# Altium schematic sheet MicroSD.SchDoc
size A; SheetNumber: 9; SheetTotal: 10
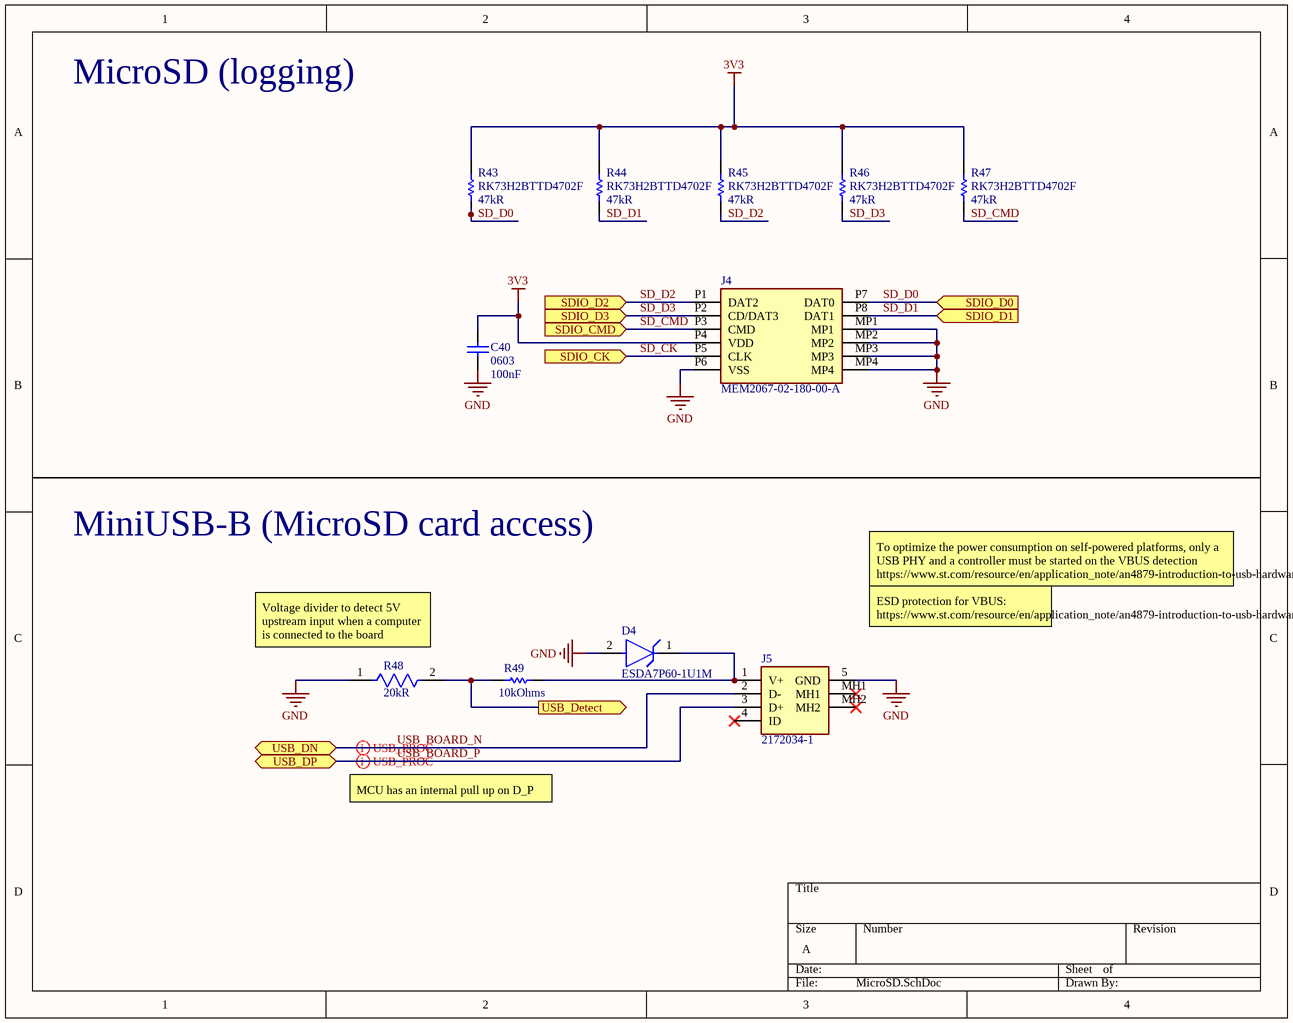
[diagram p0: MicroSD.SchDoc]

## Parts
C40  Case Code (Imperial): 0603  Capacitance: 100nF  [CAPC1608X87X35NL15T15]  (hidden comment: C0603X104K5RACTU)
D4  ESDA7P60-1U1M  [FP-1610-MFG]
J4  MEM2067-02-180-00-A  [MEM20670218000A]
J5  2172034-1  [21720341]
R43  RK73H2BTTD4702F  value 47kR  [RESC3216X70X40NL20T20]
R44  RK73H2BTTD4702F  value 47kR  [RESC3216X70X40NL20T20]
R45  RK73H2BTTD4702F  value 47kR  [RESC3216X70X40NL20T20]
R46  RK73H2BTTD4702F  value 47kR  [RESC3216X70X40NL20T20]
R47  RK73H2BTTD4702F  value 47kR  [RESC3216X70X40NL20T20]
R48  Resistance: 20kR  [FP-CRCW0805-e3-IPC_B]  (hidden comment: CRCW080520K0JNEB)
R49  Resistance: 10kOhms  [RESC1608X55X25ML10T15]  (hidden comment: RC0603JR-0710KL)

## Ports
SDIO_CK (in, see TCU[4B], Processor[2D]), SDIO_CMD (in, see TCU[4B], Processor[3B]), SDIO_D0 (in, see TCU[4B], Processor[2C]), SDIO_D1 (in, see TCU[4C], Processor[2C]), SDIO_D2 (in, see TCU[4C], Processor[2C]), SDIO_D3 (in, see TCU[4C], Processor[2D]), USB_Detect (out, see TCU[4C]), USB_DN (bidir, see TCU[4C]), USB_DP (bidir, see TCU[4C])

## Nets
3V3: C40.1 J4.P4(VDD) R43.2 R44.2 R45.2 R46.2 R47.2
GND: C40.2 D4.2(A) J4.MP1 J4.MP2 J4.MP3 J4.MP4 J4.P6(VSS) J5.5(GND) R48.1
SD_CK: J4.P5(CLK) ; port SDIO_CK
SD_CMD: J4.P3(CMD) R47.1 ; port SDIO_CMD
SD_D0: J4.P7(DAT0) R43.1 ; port SDIO_D0
SD_D1: J4.P8(DAT1) R44.1 ; port SDIO_D1
SD_D2: J4.P1(DAT2) R45.1 ; port SDIO_D2
SD_D3: J4.P2(CD/DAT3) R46.1 ; port SDIO_D3
USB_BOARD_N: J5.2(D-) ; port USB_DN
USB_BOARD_P: J5.3(D+) ; port USB_DP
USB_Detect: R48.2 R49.1 ; port USB_Detect
NetD4_1: D4.1(C) J5.1(V+) R49.2

Not connected (* = marked no-connect by the designer): J5 4(ID)* MH1* MH2*

## Layout directives
differential pair: USB_BOARD_N, USB_BOARD_P

## Notes on the sheet
- MicroSD (logging)
- MiniUSB-B (MicroSD card access)
- (near R48) Voltage divider to detect 5V upstream input when a computer is connected to the board
- ESD protection for VBUS:
  https://www.st.com/resource/en/application_note/an4879-introduction-to-usb-hardware-and-pcb-guidelines-using-stm32-mcus-stmicroelectronics.pdf
- To optimize the power consumption on self-powered platforms, only a USB PHY and a controller must be started on the VBUS detection
  https://www.st.com/resource/en/application_note/an4879-introduction-to-usb-hardware-and-pcb-guidelines-using-stm32-mcus-stmicroelectronics.pdf
- MCU has an internal pull up on D_P

## Library data of the parts
C40 = CMP-2006-03300-1: Manufacturer: Kemet; Dielectric Material: Ceramic; Tolerance: 10%; Voltage Rating: 50V; Dielectric: X7R; Dissipation Factor: 2.5%; Part Number: C0603X104K5RACTU; Supplier 1: Digi-Key; Supplier Part Number 1: 399-7969-1-ND; Manufacturer Part Number: C0603X104K5RACTU; Stock 1: 2206541; Pricing 1: 1 = 0.21000, 10 = 0.14500, 100 = 0.07340, 500 = 0.05024, 1000 = 0.04444 (USD); RoHS: Yes; Mount: Surface Mount; Case/Package: 0603; Number of Pins: 2; Case Code (Metric): 1608; Min Operating Temperature: -55°C; Max Operating Temperature: 125°C; Packaging: Tape and Reel; Package Quantity: 1; Voltage Rating (DC): 50V; Termination: SMD/SMT; Voltage: 50V; Features: Soft Termination; Length: 1.6mm; Height: 0.8mm; Width: 0.8mm; Depth: 0.8mm; Thickness: 0.034inch; Radiation Hardening: No; REACH SVHC: No SVHC; ComponentLink1URL: https://datasheet.ciiva.com/7823/1776088-7823908.pdf?src-supplier=Element14; ComponentLink1Description: https://datasheet.ciiva.com/7823/1776088-7823908.pdf?src-supplier=Element14; ComponentLink2URL: https://datasheet.ciiva.com/26948/getdatasheetpartid-385607-26948458.pdf?src-supplier=Verical; ComponentLink2Description: https://datasheet.ciiva.com/26948/getdatasheetpartid-385607-26948458.pdf?src-supplier=Verical; ComponentLink3URL: https://datasheet.ciiva.com/7823/1776088-7823909.pdf?src-supplier=Element14; ComponentLink3Description: https://datasheet.ciiva.com/7823/1776088-7823909.pdf?src-supplier=Element14; ComponentLink4URL: https://datasheet.ciiva.com/6279/kem-c1013-x7r-ft-cap-smd-6279993.pdf?src-supplier=Digi-Key; ComponentLink4Description: https://datasheet.ciiva.com/6279/kem-c1013-x7r-ft-cap-smd-6279993.pdf?src-supplier=Digi-Key; ComponentLink5URL: https://datasheet.ciiva.com/28533/1918693-28533212.pdf?src-supplier=Element14; ComponentLink5Description: https://datasheet.ciiva.com/28533/1918693-28533212.pdf?src-supplier=Element14; ComponentLink6URL: https://datasheet.ciiva.com/6279/kem-c1013-x7r-ft-cap-smd-6279999.pdf?src-supplier=Digi-Key; ComponentLink6Description: https://datasheet.ciiva.com/6279/kem-c1013-x7r-ft-cap-smd-6279999.pdf?src-supplier=Digi-Key; ComponentLink7URL: https://datasheet.ciiva.com/6279/kem-c1013-x7r-ft-cap-smd-6279990.pdf?src-supplier=Digi-Key; ComponentLink7Description: https://datasheet.ciiva.com/6279/kem-c1013-x7r-ft-cap-smd-6279990.pdf?src-supplier=Digi-Key; ComponentLink8URL: https://datasheet.ciiva.com/14597/70096394-14597743.pdf?src-supplier=Allied+Electronics; ComponentLink8Description: https://datasheet.ciiva.com/14597/70096394-14597743.pdf?src-supplier=Allied+Electronics
D4 = CMP-12225-000013-1: TVS DIODE 5V 11.6V 1610; Manufacturer: STMicroelectronics; Number Of Channels: 1; Standoff Height: 0mm; Breakdown Voltage: 6.4V; Direction: Unidirectional; Clamping Voltage: 10.2V; Peak Pulse Power: 700W; Peak Pulse Current: 60A; Max Junction Temp: +150°C; ComponentLink2Description: Datasheet; Temperature Range Low: -55°C; Package: 1610; Lead Free: Yes; Temperature Range High: +150°C; Temperature: -55°C to +150°C; Device Class L2: TVS Diodes; Category: Diode; Device Class L1: Circuit Protection; Manufacturer Part Number: ESDA7P60-1U1M; Digikey Description: TVS DIODE 5V 11.6V 1610; ComponentLink2URL: http://www.st.com/content/ccc/resource/technical/document/datasheet/44/e9/26/44/42/ee/4f/e5/DM00139972.pdf/files/DM00139972.pdf/jcr:content/translations/en.DM00139972.pdf; Reverse Standoff Voltage: 5V; RoHS: TRUE; Octopart: https://octopart.com/esda7p60-1u1m-stmicroelectronics-52112702; Height: 0.65mm; Device Class L3: unset; Automotive: No
J4 = MEM2067-02-180-00-A: Connector; Manufacturer_Name: GCT (GLOBAL CONNECTOR TECHNOLOGY); Datasheet Link: https://gct.co/files/drawings/mem2067.pdf; Height: 1.95mm; Manufacturer_Part_Number: MEM2067-02-180-00-A; Mouser Part Number: 640-MEM20670218000A; Mouser Price/Stock: https://www.mouser.co.uk/ProductDetail/GCT/MEM2067-02-180-00-A?qs=KUoIvG%2F9IlYTw%2Fcc1GlNJA%3D%3D; Supplier 1: Future Electronics; Supplier Part Number 1: 7054324
J5 = 2172034-1: Connector; Manufacturer_Name: TE Connectivity; Datasheet Link: https://www.te.com/commerce/DocumentDelivery/DDEController?Action=srchrtrv&DocNm=2172034&DocType=Customer+Drawing&DocLang=English; Height: 3.9mm; Manufacturer_Part_Number: 2172034-1; Mouser Part Number: 571-2172034-1; Mouser Price/Stock: https://www.mouser.co.uk/ProductDetail/TE-Connectivity/2172034-1?qs=Ev%252BS503VEAHBC%252BPBdsvCGg%3D%3D; Arrow Part Number: 2172034-1; Arrow Price/Stock: https://www.arrow.com/en/products/2172034-1/te-connectivity?region=nac; Supplier 1: Avnet; Supplier Part Number 1: 68AH8515
R43-R47 = CMP-2003-01472-1: Manufacturer: KOA Speer; Part Number: RK73H2BTTD4702F
R48 = CMP-02407-010660-1: RES Thick Film, 20kΩ, 5%, 0.125W, 200ppm/°C, 0805; Voltage Rating: 150V; Max Power Dissipation: 125mW; Case/Package: 0805; Number of Terminations: 2; Features: Automotive AEC-Q200; Tolerance: 5%; Height: 0.02inch; Case Code (Metric): 2012; Temperature Coefficient: 200ppm/°C; Max Operating Temperature: 155°C; Min Operating Temperature: -55°C; Length: 0.079inch; Weight: 0.000194oz; Case Code (Imperial): 0805; Composition: Thick Film; Width: 1.25mm; Lead Free: Lead Free; Power Rating: 125mW; Packaging: Tape and Reel; Termination: SMD/SMT; Package Quantity: 10000
R49 = CMP-2000-05022-1: Resistor, 10 KOhm, +/- 5%, 100 mW, -55 to 155 degC, 0603 (1608 Metric), RoHS, Tape and Reel; Manufacturer: Yageo; Voltage Rating: 50V; Temperature Coefficient: 100PPM/C; Power Rating: 100mW; Package Reference: 603; Series: RC; Case Code - mm: 1608; Packaging: Reel; Datasheet URL: http://www.farnell.com/datasheets/443971.pdf; Datasheet Version: Rev. 4, 04/2009; Operating Temperature Range: -55Cto+155C; Product: ThickFilmResistorsGeneralPurpose; Package Description: 2-Pin Surface Mount Device, Body 1.6 x 0.8 mm; Manufacturer URL: http://www.yageo.com/; Case Code - in: 0603; Tolerance: 5%; Termination Style: SMD/SMT